# Altium schematic sheet BlockDetector.SchDoc
size A3
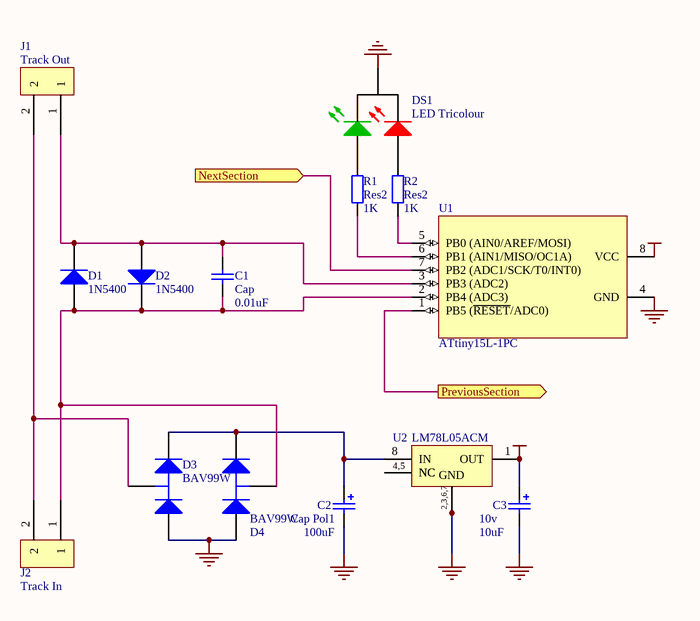
[diagram p0: BlockDetector.SchDoc]

## Parts
C1  Cap  value 0.01uF  [RAD-0.3]
C2  Cap Pol1  value 100uF  [CAPPR5-10X10.5]
C3  10v  value 10uF  [CC3216-1206]
D1  1N5400  [DIO18.84-9.6x5.6]
D2  1N5400  [DIO18.84-9.6x5.6]
D3  BAV99W  [SOT-323]
D4  BAV99W  [SOT-323]
DS1  LED Tricolour  [LED5mm TriColour]
J1  Track Out  [0.156 SIP 2 PIN]
J2  Track In  [0.156 SIP 2 PIN]
R1  Res2  value 1K  [AXIAL-0.4]
R2  Res2  value 1K  [AXIAL-0.4]
U1  ATtiny15L-1PC  [8P3]
U2  LM78L05ACM  [M08A]

## Ports
NextSection (in), PreviousSection (out)

## Nets
GND: C2.2 C3.2 D3.1(A) D4.1(A) DS1.2(K) U1.4(GND) U2.2(GND) U2.3(GND) U2.6(GND) U2.7(GND)
VCC: C3.1 U1.8(VCC) U2.1(OUT)
NextSection: U1.7(PB2_(ADC1/SCK/T0/INT0)) ; port NextSection
PreviousSection: U1.1(PB5_(~{RESET}/ADC0)) ; port PreviousSection
NetC1_1: C1.1 D1.1(A) D2.2(K) D4.3(C) J2.1 U1.2(PB4_(ADC3))
NetC1_2: C1.2 D1.2(K) D2.1(A) J1.1 U1.3(PB3_(ADC2))
NetC2_1: C2.1 D3.2(K) D4.2(K) U2.8(IN)
NetD3_3: D3.3(C) J1.2 J2.2
NetDS1_1: DS1.1(Ag) R1.2
NetDS1_3: DS1.3(Ar) R2.2
NetR1_1: R1.1 U1.6(PB1_(AIN1/MISO/OC1A))
NetR2_1: R2.1 U1.5(PB0_(AIN0/AREF/MOSI))
NetU2_4: U2.4(NC) U2.5(NC)

## Notes on the sheet
- (in symbol LM78L05ACM) 4,5; 2,3,6,7

## Library data of the parts
C1 = Cap: Capacitor; Published: 8-Jun-2000; Revision: July-2002: Re-released for DXP Platform.; Publisher: Altium Limited
C2 C3 = Cap Pol1: Polarized Capacitor (Radial); Published: 8-Jun-2000; Revision: July-2002: Re-released for DXP Platform.; Publisher: Altium Limited
D1 D2 = Diode 1N5400: 3 Amp General Purpose Rectifier; Revision 1: 11-Jul-2000: SIM Model Added.; Revision 2: 17-Jul-2002: Re-released for DXP Platform.; Package Information: Latest Revision: Aug-1999; Published: 8-Jun-2000; Datasheet: Latest Revision: 1998; Package Reference: DO-201AD; Publisher: Altium Limited
D3 D4 = BAV99W: Silicon Switching Diode Array for High-Speed Switching; Package Information: Latest Revision: Sep-2001; Published: 21-Mar-2003; Datasheet: Latest Revision: Oct-1999; Package Reference: SOT-323; Publisher: Altium Limited
DS1 = LED Tricolour: Typical Red Green Tri Color LED; Published: 8-Jun-2000; Revision: July-2002: Re-released for DXP Platform.; Publisher: Altium Limited
J1 J2 = SIP2 CONNECTOR
R1 R2 = Res2: Resistor; Published: 8-Jun-2000; Revision: July-2002: Re-released for DXP Platform.; Publisher: Altium Limited
U1 = ATtiny15L-1PC: 8-Bit AVR Microcontroller with 1K Byte of Flash Memory; Package Information: Latest Revision: revB, Sep-2001; Published: 17-Sep-2003; Datasheet: Latest Revision: 1187E-AVR-06/02; Package Reference: 8P3; Publisher: Altium Limited
U2 = LM78L05ACM: 3-Terminal Positive Regulator; Package Information: Latest Revision: Sep-1997; Code - JEDEC: MS-012-AA; Code - IPC: SO8; Published: 15-Apr-2002; Revision: 17-Sep-2003: Changed SIM name.; Datasheet: Latest Revision: Sep-1999; Package Reference: M08A; Publisher: Altium Limited